# EAGLE schematic Scooter Control Schematic (EAGLE 9.3.2)
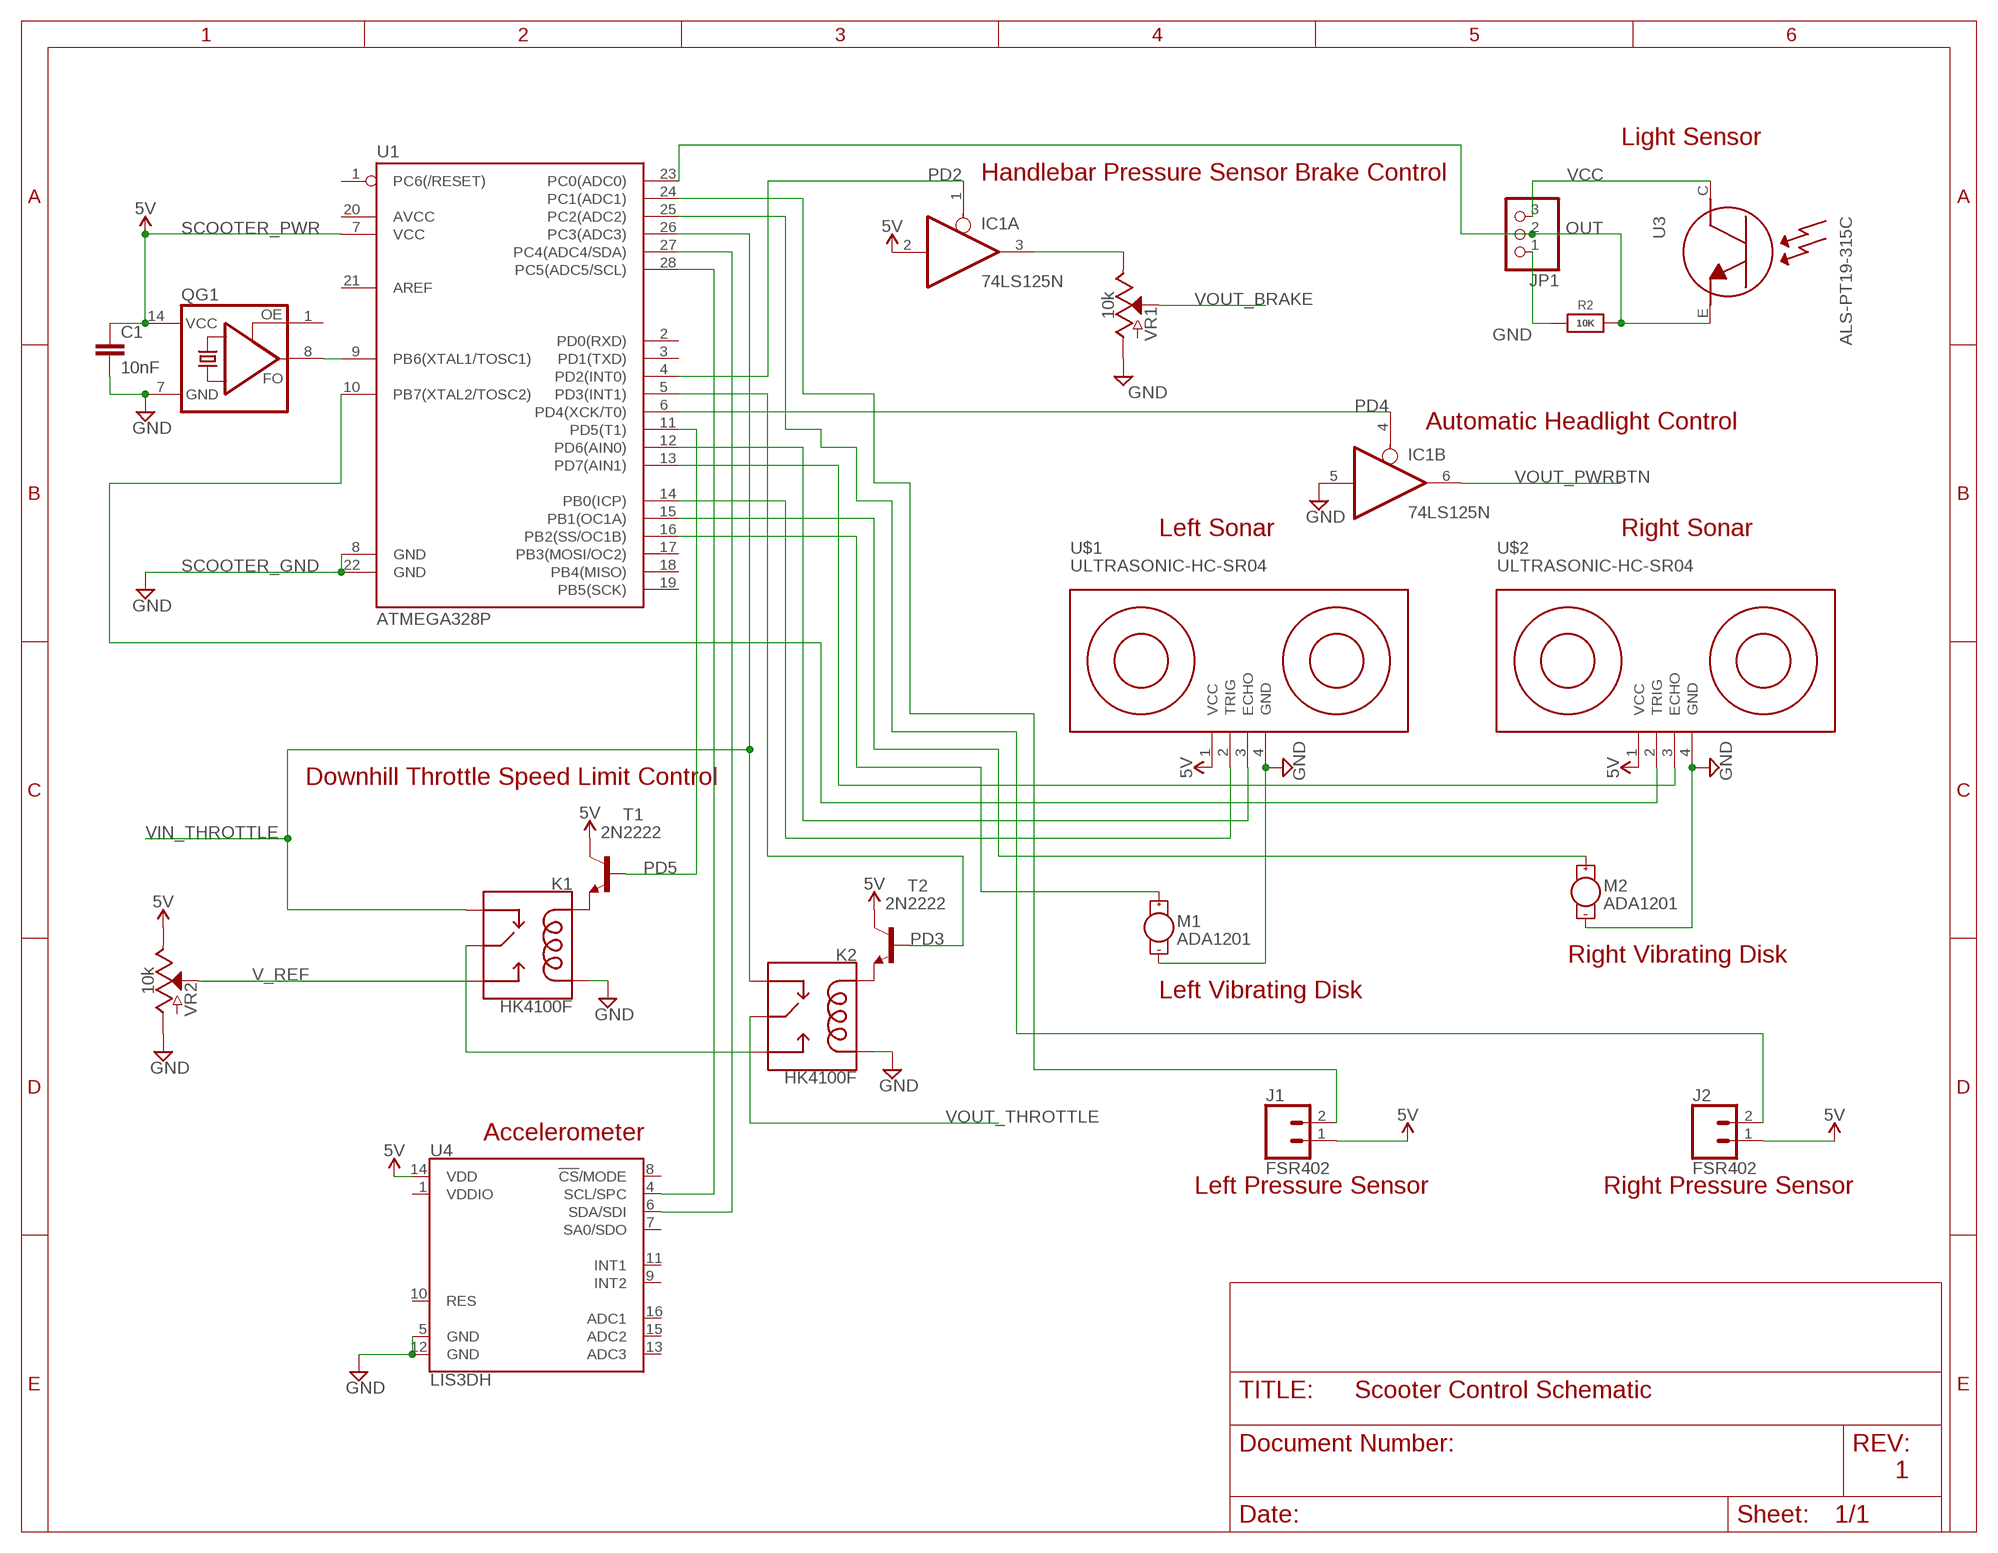
[diagram p0: schematic, sheet 1]

## Parts
C1  10nF  10NF-PTH-10MM-10000V-1-%  [CAP-PTH-10MM]
IC1  74LS125N  [DIL14]
J1  FSR402  CONN_02  [1X02]
J2  FSR402  CONN_02  [1X02]
JP1  HEADER-1X3ROUND  [1X03_ROUND]
K1  HK4100F  RELAY-SPDT-JZC-11F  [RELAY-JZC]
K2  HK4100F  RELAY-SPDT-JZC-11F  [RELAY-JZC]
M1  ADA1201  MOTOR10MM  [VIBE-MOTOR-10MM]
M2  ADA1201  MOTOR10MM  [VIBE-MOTOR-10MM]
QG1  SG51  [SG51]
R2  10K  RESISTOR_0603_NOOUT  [0603-NO]
T1  2N2222  [TO18]
T2  2N2222  [TO18]
U1  ATMEGA328P  ATMEGA328P_PDIP  [DIP28]
U3  ALS-PT19-315C  LIGHT_ALS-PT19-315C  [ALS-PT19-315C]
U4  LIS3DH  [LGA-16-3X3]
U$1  ULTRASONIC-HC-SR04  [ULTRASONIC-HC-SR04]
U$2  ULTRASONIC-HC-SR04  [ULTRASONIC-HC-SR04]
VR1  10k  POTENTIOMETER-PTH-9MM-1/20W-20%-KIT  [POT-PTH-ALPS-KIT]
VR2  10k  POTENTIOMETER-PTH-9MM-1/20W-20%-KIT  [POT-PTH-ALPS-KIT]

## Nets
5V: IC1.2(A:I) J1.1 J2.1 T1.3(C) T2.3(C) U4.14(VDD) U$1.1(VCC) U$2.1(VCC) VR2.P$1(E)
GND: C1.2 IC1.5(B:I) JP1.1 K1.1(COIL2) K2.1(COIL2) M1.- M2.- QG1.7(GND) R2.1 U4.5(GND) U4.12(GND) U$1.4(GND) U$2.4(GND) VR1.P$3(A) VR2.P$3(A)
N$1: IC1.3(A:O) VR1.P$1(E)
N$2: U1.14(PB0(ICP)) U$1.2(TRIG)
N$3: U1.12(PD6(AIN0)) U$1.3(ECHO)
N$4: K1.4(MAIN) K2.3(NO)
N$5: K2.5(COIL1) T2.1(E)
N$6: K1.5(COIL1) T1.1(E)
N$7: U1.10(PB7(XTAL2/TOSC2)) U$2.2(TRIG)
N$8: U1.13(PD7(AIN1)) U$2.3(ECHO)
N$9: U1.28(PC5(ADC5/SCL)) U4.4(SCL/SPC)
N$10: U1.27(PC4(ADC4/SDA)) U4.6(SDA/SDI)
N$11: M1.+ U1.16(PB2(SS/OC1B))
N$12: M2.+ U1.15(PB1(OC1A))
N$13: J1.2 U1.24(PC1(ADC1))
N$14: J2.2 U1.25(PC2(ADC2))
N$15: QG1.8(FO) U1.9(PB6(XTAL1/TOSC1))
OUT: JP1.2 R2.2 U1.23(PC0(ADC0)) U3.E
PD2: IC1.1(A:OE) U1.4(PD2(INT0))
PD3: T2.2(B) U1.5(PD3(INT1))
PD4: IC1.4(B:OE) U1.6(PD4(XCK/T0))
PD5: T1.2(B) U1.11(PD5(T1))
SCOOTER_GND: U1.8(GND) U1.22(GND) ; supply symbol labelled GND
SCOOTER_PWR: C1.1 QG1.14(VCC) U1.7(VCC) ; supply symbol labelled 5V
V_REF: K1.3(NO) VR2.P$2(S)
VCC: JP1.3 U3.C
VIN_THROTTLE: K1.2(NC) K2.2(NC) U1.26(PC3(ADC3))
VOUT_BRAKE: VR1.P$2(S)
VOUT_PWRBTN: IC1.6(B:O)
VOUT_THROTTLE: K2.4(MAIN)
Unconnected: IC1.8(C:O) IC1.9(C:I) IC1.10(C:OE) IC1.11(D:O) IC1.12(D:I) IC1.13(D:OE) QG1.1(OE) U1.1(PC6(/RESET)) U1.2(PD0(RXD)) U1.3(PD1(TXD)) U1.17(PB3(MOSI/OC2)) U1.18(PB4(MISO)) U1.19(PB5(SCK)) U1.20(AVCC) U1.21(AREF) U4.1(VDDIO) U4.7(SA0/SDO) U4.8(!CS!/MODE) U4.9(INT2) U4.10(RES) U4.11(INT1) U4.13(ADC3) U4.15(ADC2) U4.16(ADC1)

## Notes on the sheet
- Light Sensor
- Handlebar Pressure Sensor Brake Control
- Automatic Headlight Control
- Left Sonar | Right Sonar
- Downhill Throttle Speed Limit Control
- Right Vibrating Disk
- Left Vibrating Disk
- Accelerometer
- Left Pressure Sensor | Right Pressure Sensor
- 1

## Power pins joined to a net without a drawn wire
GND: IC1.7(P:GND)
VCC: IC1.14(P:VCC)

## Library data of the parts
C1 = SparkFun-Capacitors:10NF: 0.01uF/10nF/10,000pF ceramic capacitors A capacitor is a passive two-terminal electrical component used to store electrical energy temporarily in an electric field. CAP-09321; PROD_ID: CAP-09321
IC1 = 74xx-us:74*125: Quad bus BUFFER, 3-state
J1 J2 = SparkFun-Connectors:CONN_02: Multi connection point. Often used as Generic Header-pin footprint for 0.1 inch spaced/style header connections On any of the 0.1 inch spaced packages, you can populate with these: Break Away Headers - Straight <https://www.sparkfun.com/products/116> (PRT-00116) Break Away Male Headers - Right Angle <https://www.sparkfun.com/products/553> (PRT-00553) Female Headers <https://www.sparkfun.com/products/115> (PRT-00115) Break Away Headers - Machine Pin <https://www.sparkfun.com/products/117> (PRT-00117) Break Away Female Headers - Swiss Machine Pin <https://www.sparkfun.com/products/743> (PRT-00743) For SCREWTERMINALS and SPRING TERMINALS visit here: Screw Terimnals on SparkFun.com <https://www.sparkfun.com/search/results?term=Screw+Terminals> (5mm/3.5mm/2.54mm spacing) This device is also useful as a general connection point to wire up your design to another part of your project. Our various solder wires solder well into these plated through hole pads. Hook-Up Wire - Assortment (Stranded, 22 AWG) <https://www.sparkfun.com/products/11375> (PRT-11375) Hook-Up Wire - Assortment (Solid Core, 22 AWG) <https://www.sparkfun.com/products/11367> (PRT-11367) View the entire wire category on our website here <https://www.sparkfun.com/categories/141> Special notes: Molex polarized connector foot print use with: PRT-08233 with associated crimp pins and housings. 2.54_SCREWTERM for use with PRT-10571. 3.5mm Screw Terminal footprints for PRT-08084 5mm Screw Terminal footprints for use with PRT-08432; SPICEPREFIX: B
JP1 = microbuilder:HEADER-1X3: PIN HEADER
K1 K2 = SparkFun-Electromechanical:RELAY-SPDT: SPDT Electromechanical Relay Single-pole, double-throw sealed relays. When current is applied to the coil, it throws a simple changeover switch, terminating the connection from the NC contact to ground and closing the NO contact. Use them to switch high voltage/high current devices. SparkFun Products JQX-15F: Relay SPDT Sealed - 20A <https://www.sparkfun.com/products/10924> (COM-10924) JZC-11F: Relay SPDT Sealed <https://www.sparkfun.com/products/100> (COM-00100); PROD_ID: COMP-09533; SF_SKU: COM-00100; SPICEPREFIX: X
M1 M2 = SparkFun-Electromechanical:MOTOR: Motor (Single-Phase) Two-terminal, single-phase motors. SparkFun Products Vibration Motor <https://www.sparkfun.com/products/8449> (ROB-08449) Physical dimension and wire connections for this powerful vibration motor. Motor has a self adhesive backing.; PROD_ID: COMP-08572; SF_SKU: ROB-08449; SPICEPREFIX: B
QG1 = crystal:SG51: CRYSTAL RESONATOR; OC_FARNELL: unknown; OC_NEWARK: unknown
R2 = microbuilder:RESISTOR: Resistors For new designs, use the packages preceded by an '_' character since they are more reliable: The following footprints should be used on most boards: _0402 - Standard footprint for regular board layouts _0603 - Standard footprint for regular board layouts _0805 - Standard footprint for regular board layouts _1206 - Standard footprint for regular board layouts For extremely tight-pitch boards where space is at a premium, the following 'micro-pitch' footprints can be used (smaller pads, no silkscreen outline, etc.): _0402MP - Micro-pitch footprint for very dense/compact boards _0603MP - Micro-pitch footprint for very dense/compact boards _0805MP - Micro-pitch footprint for very dense/compact boards _1206MP - Micro-pitch footprint for very dense/compact boards
T1 T2 = transistor:2N2222: NPN TRANSISTOR
U1 = SparkFun-IC-Microcontroller:ATMEGA328P_PDIP: Atmel 328P Through hole ATMEGA328P uC used in the Arduino 32kb flash, 1k EEPROM, 2k SRAM Datasheet <http://www.sparkfun.com/datasheets/Components/SMD/ATMega328.pdf> SparkFun Products Storefront component: AVR 28 Pin 20MHz 32K 6A/D - ATMega328P <https://www.sparkfun.com/products/9061> (COM-09061) SparkFun Simon Says - Through-Hole Soldering Kit <https://www.sparkfun.com/products/10547> (KIT-10547) SparkFun Learn to Solder - Simon Says <https://www.sparkfun.com/products/13708> (KIT-13708) SparkFun BigTime Watch Kit <https://www.sparkfun.com/products/11734> (KIT-11734) SparkFun ClockIt <https://www.sparkfun.com/products/10930> (KIT-10930) SparkFun Serial Enabled LCD Kit <https://www.sparkfun.com/products/10097> (LCD-10097) SparkFun Simon Tilts - Through Hole Soldering Kit <https://www.sparkfun.com/products/12634> (KIT-12634) SparkFun Frequency Counter Kit <https://www.sparkfun.com/products/10140> (KIT-10140) FabFM Radio Kit <https://www.sparkfun.com/products/11043> (KIT-11043) SparkFun Binary Blaster Kit <https://www.sparkfun.com/products/12037> (KIT-12037) SparkFun Metro-Gnome <https://www.sparkfun.com/products/9236> (KIT-09236) ATmega328 with Arduino Optiboot (Uno) <https://www.sparkfun.com/products/10524> (DEV-10524); PROD_ID: IC-09136; SPICEPREFIX: X; VALUE: 328P
U3 = microbuilder:LIGHT_ALS-PT19-315C: ALS-PT19-315C - Analog Light Sensor VCC: 2.5-5.5V
U4 = SparkFun-Sensors:LIS3DH: ST Microelectronics LIS3DH 3-Axis ±2/4/8/16g SPI/I2C Accelerometer The LIS3DH is a three axis MEMS linear accelerometer in the "nano" family. It has a digital I2C/SPI serial interface which makes it ideal for using in embedded applications. The device also features ultra low-power operational modes that allow advanced power saving and smart sleep to wake-up functions, built in detections with interrupts, and auxiliary ADC inputs Datasheet-XXXX <http://www.sparkfun.com/datasheets/Sensors/Accelerometer/LIS3DH.pdf> SparkFun Products SparkFun Triple Axis Accelerometer Breakout - LIS3DH <https://www.sparkfun.com/products/10345> (SEN-XXXXX) Triple Axis Accelerometer - LIS3DH <https://www.sparkfun.com/products/9755> (SEN-XXXXX); PROD_ID: IC-13419; SF_ID: N/A
U$1 U$2 = diy-modules:ULTRASONIC-HC-SR04: Ultrasonic Ranging Module HC-SR04 More details available here: http://randomnerdtutorials.com/complete-guide-for-ultrasonic-sensor-hc-sr04/ Click here to find device on ebay.com <http://www.ebay.com/sch/hc+sr04+ultrasonic>
VR1 VR2 = SparkFun-Resistors:POTENTIOMETER: Potentiometer (Pot) Three-terminal potentiometers, with an adjustable wiper and two adjustable resistors. A pot can be used to create a configurable voltage divider, or as a variable resistor. Variants ALPS_POT and ALPS_POT_KIT - PTH, breadboard compatible, 9mm square pots Rotary Potentiometer - Linear (10k ohm) <https://www.sparkfun.com/products/9288> (COM-09288) The KIT variant exposes copper on only one side of the PTH pad, so the part can only be assembled on one side of the PCB. Useful for beginner soldering kits.; PROD_ID: RES-09177; SF_SKU: COM-09288